# Altium schematic sheet Support.SchDoc
size A4
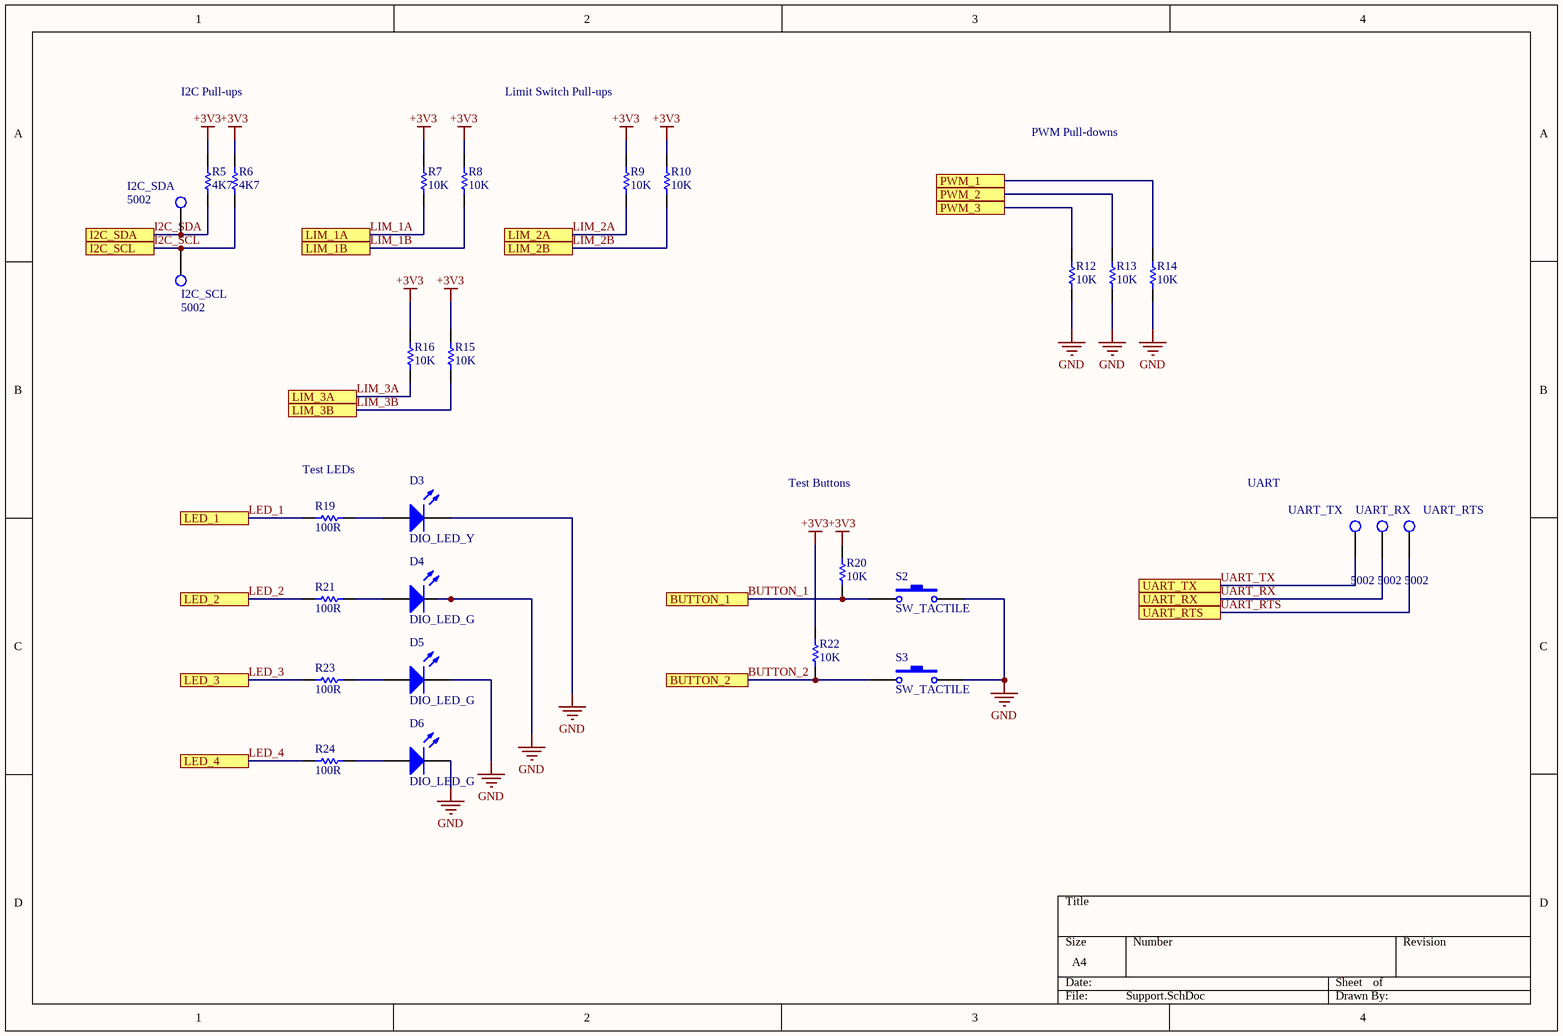
[diagram p0: Support.SchDoc]

## Parts
D3  DIO_LED_Y  [LED_0805_LINE]
D4  DIO_LED_G  [LED_0805_LINE]
D5  DIO_LED_G  [LED_0805_LINE]
D6  DIO_LED_G  [LED_0805_LINE]
R5  value 4K7  [RESC0603(1608)_N]  (hidden comment: RES_4K7_0603)
R6  value 4K7  [RESC0603(1608)_N]  (hidden comment: RES_4K7_0603)
R7  value 10K  [RESC0603(1608)_N]  (hidden comment: RES_10K_0603)
R8  value 10K  [RESC0603(1608)_N]  (hidden comment: RES_10K_0603)
R9  value 10K  [RESC0603(1608)_N]  (hidden comment: RES_10K_0603)
R10  value 10K  [RESC0603(1608)_N]  (hidden comment: RES_10K_0603)
R12  value 10K  [RESC0603(1608)_N]  (hidden comment: RES_10K_0603)
R13  value 10K  [RESC0603(1608)_N]  (hidden comment: RES_10K_0603)
R14  value 10K  [RESC0603(1608)_N]  (hidden comment: RES_10K_0603)
R15  value 10K  [RESC0603(1608)_N]  (hidden comment: RES_10K_0603)
R16  value 10K  [RESC0603(1608)_N]  (hidden comment: RES_10K_0603)
R19  value 100R  [RESC0603(1608)_N]  (hidden comment: RES_100R_0603)
R20  value 10K  [RESC0603(1608)_N]  (hidden comment: RES_10K_0603)
R21  value 100R  [RESC0603(1608)_N]  (hidden comment: RES_100R_0603)
R22  value 10K  [RESC0603(1608)_N]  (hidden comment: RES_10K_0603)
R23  value 100R  [RESC0603(1608)_N]  (hidden comment: RES_100R_0603)
R24  value 100R  [RESC0603(1608)_N]  (hidden comment: RES_100R_0603)
S2  SW_TACTILE  [B3U-1100P]
S3  SW_TACTILE  [B3U-1100P]
TP6  I2C_SDA  MPN: 5002  [TESTPOINT_LOOP]
TP7  I2C_SCL  MPN: 5002  [TESTPOINT_LOOP]
TP8  UART_TX  MPN: 5002  [TESTPOINT_LOOP]
TP9  UART_RX  MPN: 5002  [TESTPOINT_LOOP]
TP10  UART_RTS  MPN: 5002  [TESTPOINT_LOOP]

## Ports
BUTTON_1, BUTTON_2, I2C_SCL, I2C_SDA, LED_1, LED_2, LED_3, LED_4, LIM_1A, LIM_1B, LIM_2A, LIM_2B, LIM_3A, LIM_3B, PWM_1, PWM_2, PWM_3, UART_RTS, UART_RX, UART_TX

## Nets
+3V3: R5.2 R6.2 R7.2 R8.2 R9.2 R10.2 R15.2 R16.2 R20.2 R22.1
GND: D3.2(K) D4.2(K) D5.2(K) D6.2(K) R12.1 R13.1 R14.1 S2.2 S3.2
BUTTON_1: R20.1 S2.1 ; port BUTTON_1
BUTTON_2: R22.2 S3.1 ; port BUTTON_2
I2C_SCL: R6.1 TP7.1(=value) ; port I2C_SCL
I2C_SDA: R5.1 TP6.1(=value) ; port I2C_SDA
LED_1: R19.1 ; port LED_1
LED_2: R21.1 ; port LED_2
LED_3: R23.1 ; port LED_3
LED_4: R24.1 ; port LED_4
LIM_1A: R7.1 ; port LIM_1A
LIM_1B: R8.1 ; port LIM_1B
LIM_2A: R9.1 ; port LIM_2A
LIM_2B: R10.1 ; port LIM_2B
LIM_3A: R16.1 ; port LIM_3A
LIM_3B: R15.1 ; port LIM_3B
PWM_1: R14.2 ; port PWM_1
PWM_2: R13.2 ; port PWM_2
PWM_3: R12.2 ; port PWM_3
UART_RTS: TP10.1(=value) ; port UART_RTS
UART_RX: TP9.1(=value) ; port UART_RX
UART_TX: TP8.1(=value) ; port UART_TX
NetD3_1: D3.1(A) R19.2
NetD4_1: D4.1(A) R21.2
NetD5_1: D5.1(A) R23.2
NetD6_1: D6.1(A) R24.2

## Notes on the sheet
- I2C Pull-ups
- Limit Switch Pull-ups
- PWM Pull-downs
- (near R19) Test LEDs
- Test Buttons
- UART

## Library data of the parts
D3 = DIO_LED_Y: LED YELLOW DIFFUSED 0805 SMD; Manufacturer: OSRAM; MPN: LY R976-PS-36; Forward Voltage Drop: 2.2V; Package: 0805 (2012 Metric); Digikey Part Number: 475-2560-1-ND
D4-D6 = DIO_LED_G: LED GREEN DIFFUSED 0805 SMD; Manufacturer: OSRAM; MPN: LG R971-KN-1; Forward Voltage Drop: 2.2V; Package: 0805 (2012 Metric); Digikey Part Number: 475-1410-1-ND
R5 R6 = RES_4K7_0603: RES SMD 4.7K OHM 5% 1/10W 0603; Manufacturer: Yageo; MPN: RC0603JR-074K7L; Package: 0603 (1608 Metric); Dimensions: 0.063" L x 0.031" W (1.60mm x 0.80mm); Tolerance: 5%; Digikey Part Number: 311-4.7KGRCT-ND
R7-R10 R12-R16 R20 R22 = RES_10K_0603: RES SMD 10K OHM 5% 1/10W 0603; Manufacturer: Yageo; MPN: RC0603JR-0710KL; Package: 0603 (1608 Metric); Dimensions: 0.063" L x 0.031" W (1.60mm x 0.80mm); Tolerance: 5%; Digikey Part Number: 311-10KGRCT-ND
R19 R21 R23 R24 = RES_100R_0603: RES SMD 100 OHM 1% 1/10W 0603; Manufacturer: Yageo; MPN: RC0603FR-07100RL; Package: 0603 (1608 Metric); Dimensions: 0.063" L x 0.031" W (1.60mm x 0.80mm); Tolerance: 1%; Digikey Part Number: 311-100HRCT-ND
S2 S3 = SW_TACTILE: Tactile Switch (Grey); Manufacturer: Omron Electronics Inc-EMC Div; Digikey Part Number: SW1021TR-ND; MPN: B3U-1100P
TP6-TP10 = TESTPOINT_LOOP: PC TEST POINT MINIATURE WHITE; Manufacturer: Keystone Electronics; Digikey Part Number: 36-5002-ND